# Altium project Power+Solar_PCB.PrjPcb
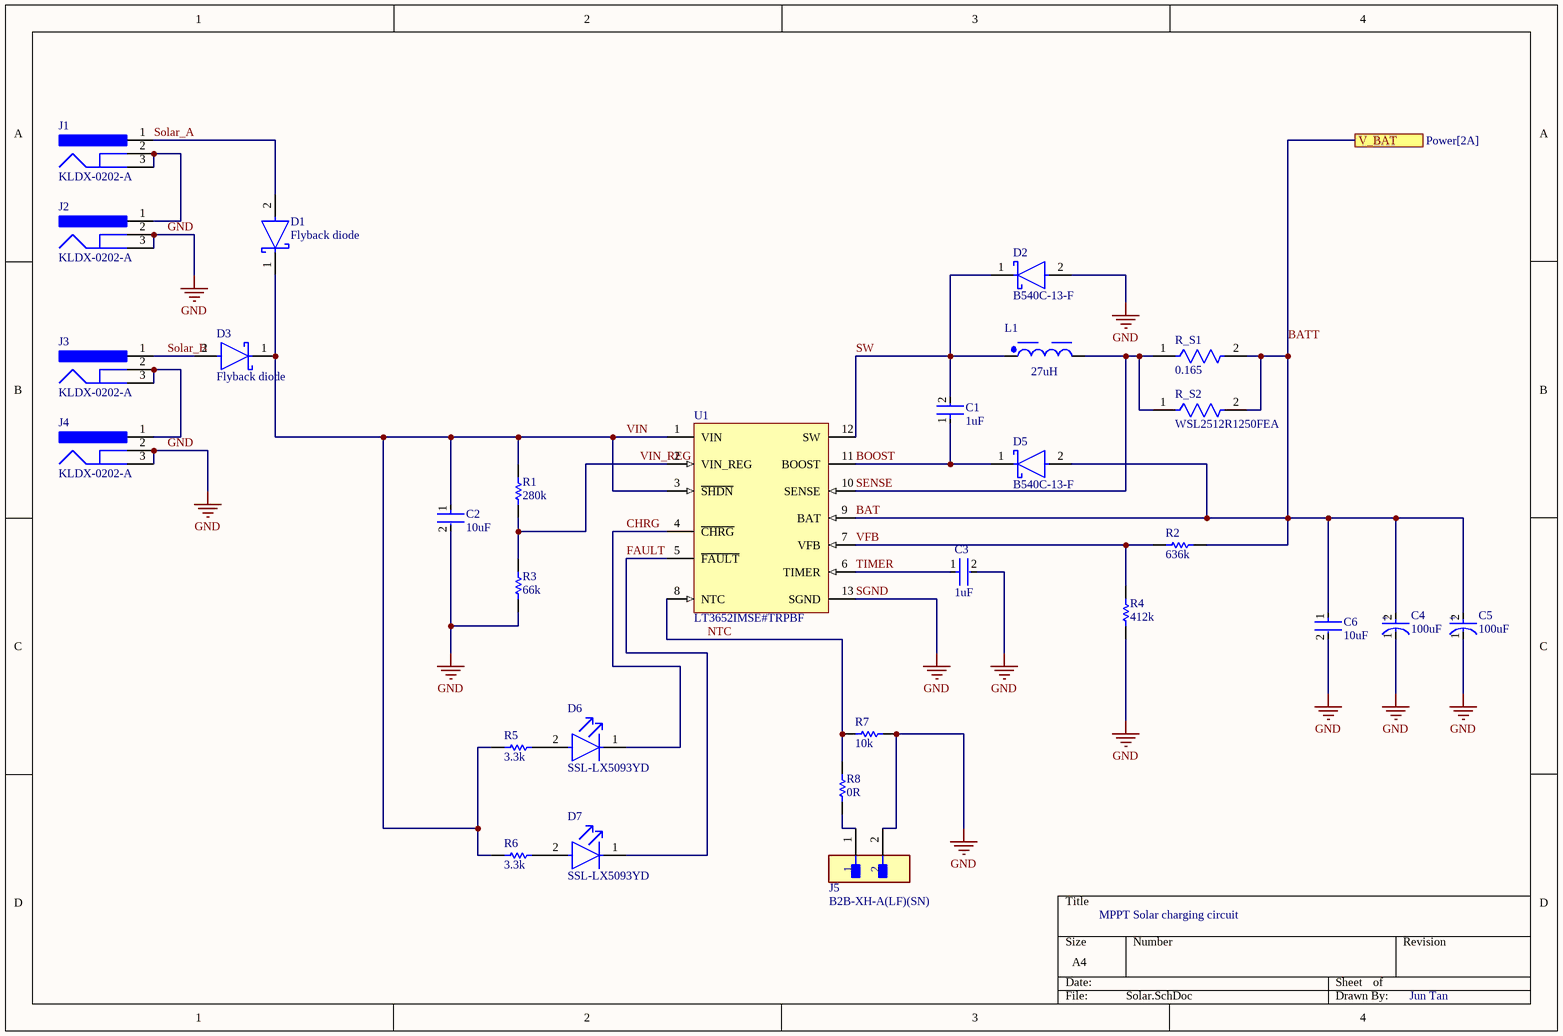
[diagram p0: Solar.SchDoc]
2 sheets, 49 parts. Net scope: flat (ports and power ports of the same name join across sheets).
Board file: Power+Solar_PCB_FINAL.pCBdOC
Sheets:
  Solar.SchDoc
  Power.SchDoc

## Sheet Solar.SchDoc
size A4; SheetNumber: 1; SheetTotal: 2

### Parts
C1  1uF  [FP-CC1206-1_25-MFG]
C2  10uF  [FP-GRM31C-0_2-e0_3_0_8-MFG]
C3  1uF  [FP-CC1206-1_25-MFG]
C4  100uF  [FP-RAD-TH-D_6_3_0_5-L_11-MFG]
C5  100uF  [FP-RAD-TH-D_6_3_0_5-L_11-MFG]
C6  10uF  [FP-GRM31C-0_2-e0_3_0_8-MFG]
D1  Flyback diode  [FP-DO-201AD-MFG]
D2  B540C-13-F  [FP-SMC-MFG]
D3  Flyback diode  [FP-DO-201AD-MFG]
D5  B540C-13-F  [FP-SMC-MFG]
D6  SSL-LX5093YD  [FP-SSL-LX5093YD-MFG]
D7  SSL-LX5093YD  [FP-SSL-LX5093YD-MFG]
J1  KLDX-0202-A  [KYCN-KLDX-0202-A_V]
J2  KLDX-0202-A  [KYCN-KLDX-0202-A_V]
J3  KLDX-0202-A  [KYCN-KLDX-0202-A_V]
J4  KLDX-0202-A  [KYCN-KLDX-0202-A_V]
J5  B2B-XH-A(LF)(SN)  [FP-B2B-XH-A_LF_SN-MFG]
L1  27uH  [WE-PD_7345R]
R1  280k  [RESA60-630X240]
R2  636k  [RESA60-630X240]
R3  66k  [RESA60-630X240]
R4  412k  [RESA60-630X240]
R5  3.3k  [RESA60-630X240]
R6  3.3k  [RESA60-630X240]
R7  10k  [RESA60-630X240]
R8  0R  [RESA60-630X240]
R_S1  0.165  [FP-WSL2512-MFG]
R_S2  WSL2512R1250FEA  [FP-WSL2512-MFG]
U1  LT3652IMSE#TRPBF  [LT-MSE-12-EDP_L]

### Ports
V_BAT (see Power[2A])

### Nets
GND: C2.2 C3.2 C4.1(C) C5.1(C) C6.2 D2.2(A) J2.2 J2.3 J4.2 J4.3 J5.2 R3.1 R4.1 R7.1 U1.13(SGND)  [also labelled SGND]
BAT: C4.2(A) C5.2(A) C6.1 D5.2(A) R2.1 R_S1.2 R_S2.2 U1.9(BAT) ; port V_BAT  [also labelled BATT]
BOOST: C1.1 D5.1(C) U1.11(BOOST)
CHRG: D6.1(C) U1.4(~{CHRG})
FAULT: D7.1(C) U1.5(~{FAULT})
NTC: R7.2 R8.2 U1.8(NTC)
SENSE: L1.2 R_S1.1 R_S2.1 U1.10(SENSE)
Solar_A: D1.2(A) J1.1
Solar_B: D3.2(A) J3.1
SW: C1.2 D2.1(C) L1.1 U1.12(SW)
TIMER: C3.1 U1.6(TIMER)
VFB: R2.2 R4.2 U1.7(VFB)
VIN: C2.1 D1.1(C) D3.1(C) R1.2 R5.2 R6.2 U1.1(VIN) U1.3(~{SHDN})
VIN_REG: R1.1 R3.2 U1.2(VIN_REG)
NetD6_2: D6.2(A) R5.1
NetD7_2: D7.2(A) R6.1
NetJ1_2: J1.2 J1.3 J2.1
NetJ3_2: J3.2 J3.3 J4.1
NetJ5_1: J5.1 R8.1

### Notes on the sheet
- MPPT Solar charging circuit
- Jun Tan
- (in symbol CMP-05427-000856-1) +

### Library data of the parts
C1 C3 = CMP-03422-001060-1: CAP CER 1UF 25V X7R 1206; Manufacturer: Yageo; Manufacturer Part Number: CC1206MKX7R8BB105; Automotive Grade: NA; Material: Ceramic; Temperature Coefficient: 15%; Tolerance: 0.2; Automotive: No; Category: Cap; Device Class L1: Passive Components; Voltage Rating: 25 V; Height: 1.45mm; Temperature Range Low: -55°C; Package: CC1206-1.25; ComponentLink2Description: Datasheet; Device Class L2: Capacitors; RoHS: TRUE; Capacitance: 1 uF; Temperature Characteristic: X7R; Temperature: -55°C to +125°C; Octopart: https://octopart.com/cc1206mkx7r8bb105-yageo-51849253; ComponentLink2URL: http://www.yageo.com/documents/recent/UPY-NP0X7R_HV_1KV-to-3KV_11.pdf; Temperature Range High: +125°C; Lead Free: Yes; Mouser Description: 1206 1 uF 25 V ±20% Tolerance X7R SMT Multilayer Ceramic Capacitor; Value: 1 uF; Footprint Url: http://www.yageo.com/exep/pages/download/literatures/UPY-C_GEN_24.pdf; Digikey Description: CAP CER 1UF 25V X7R 1206; Device Class L3: Ceramic Capacitors
C2 C6 = CMP-06035-003589-1: Chip Multilayer Ceramic Capacitors for General Purpose, 1206, 10uF, X7R, 15%, 10%, 25V; Case Code (Imperial): 1206; Voltage Rating (DC): 25V; Voltage Rating: 25V; Length: 3.2mm; Lead Free: Lead Free; Thickness: 0.071inch; Package Quantity: 1; Width: 1.6mm; Max Operating Temperature: 125°C; Number of Pins: 2; Height: 1.6mm; Case Code (Metric): 3216; REACH SVHC: No SVHC; Radiation Hardening: No; Case/Package: 1206; Material: Ceramic; Tolerance: 10%; Voltage: 25V; Mount: Surface Mount; Packaging: Tape and Reel; Dielectric: X7R; Termination: SMD/SMT; Min Operating Temperature: -55°C; Capacitance: 10uF; Depth: 1.6mm
C4 C5 = CMP-05427-000856-1: Aluminum Electrolytic Capacitors (Radial Lead Type) 100uF ±20% 25V; Lead Diameter: 0.5mm; Polarity: Polar; Ripple Current: 455mA; Impedance: 130mR; Life (Hours): 2000Hour; Length: 11mm; Min Operating Temperature: -40°C; Termination: Radial; Diameter: 6mm; Lead Pitch: 5mm; Tolerance: 20%; Capacitance: 100uF; Case/Package: Radial; Voltage Rating (DC): 25V; Height - Seated (Max): 0.5inch; RoHS Compliant: Yes; Series: FM; Package Quantity: 2000; Voltage Rating: 25V; Max Operating Temperature: 105°C; Mount: Through Hole; ESR (Equivalent Series Resistance): 130mR; Packaging: Tape and Reel
D1 D3 = CMP-12187-000025-1: DIODE SCHOTTKY 40V 3A DO201AD; Manufacturer Part Number: 1N5822; Manufacturer: STMicroelectronics; Max Junction Temp: +150°C; Peak Reverse Current: 2mA; Max Surge Forward Current: 80A; Temperature Range High: +150°C; Automotive: No; RoHS: TRUE; ComponentLink2Description: Datasheet; Lead Free: Yes; Octopart: https://octopart.com/1n5822-stmicroelectronics-323225; Device Class L2: Diodes; Max Repetitive Reverse Voltage: 40V; Temperature: to +150°C; Height: 5.3mm; Category: Diode; Digikey Description: DIODE SCHOTTKY 40V 3A DO201AD; ComponentLink2URL: https://www.st.com/resource/en/datasheet/1n5822.pdf; Device Class L3: Schottky Diodes; Device Class L1: Discrete Semiconductors; Forward Current: 3A; Mouser Description: Schottky Diodes & Rectifiers Vr/40V Io/3A BULK; Package: DO-201AD
D2 D5 = CMP-2000-05097-3: DIODE SCHOTTKY 40V 5A SMC; Manufacturer: Diodes Inc.; Automotive Grade: NA; Peak Reverse Current: 0.5mA; Value: 300pF; Max Junction Temp: +150°C; Max Surge Forward Current: 100A; Standoff Height: 0.1mm; Digikey Description: DIODE SCHOTTKY 40V 5A SMC; Temperature Range Low: -55°C; Manufacturer Part Number: B540C-13-F; Octopart: https://octopart.com/b540c-13-f-diodes+inc.-325873; Lead Free: Yes; Reverse Voltage: 40V; RoHS: TRUE; Category: Diode; Mouser Description: Diode: Schottky rectifying; SMD; 40V; 5A; SMC; Package: reel, tape; ComponentLink2Description: Datasheet; Temperature Range High: +150°C; Automotive: No; Footprint Url: https://www.diodes.com/assets/Package-Files/SMC.pdf; Device Class L3: Schottky Diodes; Height: 2.5mm; Forward Current: 5A; Temperature: -55°C to +150°C; Package: SMC; ComponentLink2URL: https://www.diodes.com/assets/Datasheets/ds13012.pdf; Device Class L2: Diodes; Max Repetitive Reverse Voltage: 40V; Device Class L1: Discrete Semiconductors; Capacitance: 300pF
D6 D7 = CMP-57192-000007-1: LED YELLOW DIFFUSED T-1 3/4 T/H; Test Current: 20mA; Number of LEDs: 1; Dominant Wavelength: 568nm; Wavelength: 585nm; Forward Voltage: 2.1V; Lens Style: Dome; Viewing Angle: 60°; Luminous Intensity: 30mcd; Min Operating Temperature: -40°C; Packaging: Bulk; Width: 1.5inch; Lead Free: Lead Free; Number of Pins: 2; Color: Yellow; Case/Package: Radial; Forward Current: 20mA; REACH SVHC: No SVHC; Lens Transparency: Diffused; Weight: 0.01lb; Height: 8.6mm; Package Quantity: 1000; Series: -; Length: 0.5inch; Illumination Color: Yellow; Mount: Through Hole; Diameter: 5mm; RoHS Compliant: Yes; Lens Color: Yellow; Max Operating Temperature: 85°C
J1-J4 = CMP-1673-00001-5: DC Power Jack, 24 V, 3.5 A, -25 to 85 degC, 3-Pin THD, RoHS; Manufacturer: Kycon; Voltage Rating: 24 V; Current Rating: 3.5 A; Height: 10.8 mm; Length: 9.2 mm; Pins: 2; Housing Material: PBT; Connector Type: Power; ComponentLink2URL: http://www.kycon.com/Pub_Eng_Draw/KLDX-0202-X.PDF; PackageDescription: 3-Pin Through Hole Device, Body 14.5 x 9 mm; Max Operating Temperature: 85 degC; Min Operating Temperature: -25 degC; PackageReference: KLDX-0202-A; Contact Gender: Female; Package Quantity: 500; Mount: Through Hole; Colour: Black; Contact Plating: Tin; DatasheetVersion: Rev. D3, 06/2013; ComponentLink2Description: Datasheet; RoHSCompliant: true; Mounting Technology: Through Hole; ComponentLink1Description: Manufacturer URL; Contact Material: Brass; ComponentLink1URL: http://www.kycon.com/
J5 = CMP-2000-05888-3: CONN HEADER VERT 2POS 2.5MM; Current Rating: 3A; Voltage Rating: 250V; Number of Contacts: 2; Contact Resistance: 20mR; Wire/Cable Gauge: 22AWG; Insulation Resistance: 1GR; Connector Type: Male Pin; Packaging: Bulk; Contact Material: Brass; Lead Free: Lead Free; Orientation: Straight; Contact Plating: Tin; Max Current Rating: 3A; Termination: Solder; Fastening Type: Detent; Depth: 5.75mm; Housing Material: Polyamide; REACH SVHC: No SVHC; Series: XH; Voltage Rating (AC): 250V; Number of Positions: 2; Color: Natural; Contact Type: Male Pin; Max Voltage Rating (DC): 250V; Pitch: 2.5mm; Lead Pitch: 2.5mm; Mount: Through Hole; Max Operating Temperature: 85°C; Length: 7.4mm; Max Voltage Rating (AC): 250V; Min Operating Temperature: -25°C; Number of Rows: 1; Housing Color: White
L1 = CMP-1396-00053-3: WE-PD Robust SMT Shielded Power Inductor; Self Resonant Frequency: 13MHz; RMS Current (Irms): 1.24A; Inductance: 27µH; Test Frequency: 1kHz; Tolerance: 20%; Series Resistance: 150mΩ; Saturation Current: 1.55A; Core Material: Ferrite; DC Resistance (DCR): 120mΩ; Ambient Temperature Range Low: -40°C; Ambient Temperature Range High: 85°C; Mount: Surface Mount; Length: 7.3mm; Max Operating Temperature: 125°C; Min Operating Temperature: -40°C; Max DC Current: 1.24A; Case/Package: Nonstandard; Depth: 7.3mm; Composition: Wirewound; Inductance Tolerance: 20%; RoHS: Compliant; Resistance: 150mΩ; Height - Seated (Max): 4.4958mm; Number of Pins: 2; Shielding: Shielded; REACH SVHC: Unknown; Width: 7.3mm; Current Rating: 1.24A; Termination: SMD/SMT; Height: 4.5mm
R1-R8 = CMP-1659-00071-1: Axial Resistor, 100 Ohm, +/- 1%, 0.25 W, -55 to 155 degC, 2-Pin THD, RoHS, Bulk; Voltage Rating: 250 V; Resistance: 4.75 kohm; Power Rating: 250 mW; Type (Resistor): Metal Film; Package Quantity: 200; RoHSCompliant: true; ComponentLink1URL: http://www.yageo.com/; ComponentLink1Description: Manufacturer URL; Case\Package: Axial; ComponentLink2Description: Datasheet; Length: 0.248 inch; PackageReference: MFR-25; Max Operating Temperature: 155 degC; Min Operating Temperature: -55 degC; DatasheetVersion: Apr-13; Mount: Through Hole; PackageDescription: 2-Pin Axial Lead, Dia 2.4 mm, Body Length 6.3 mm; Packaging: Bulk; Tolerance: 1%; ComponentLink2URL: http://www.yageo.com/documents/recent/Yageo%20LR_MFR_2013.pdf
R_S1 R_S2 = CMP-02407-012716-1: Res Metal Strip 2512 0.125 Ohm 1% 1W ±75ppm/°C Molded SMD SMD Embossed Plastic T/R; Resistance: 125mR; Packaging: Tape and Reel; RoHS Compliant: Yes; Resistor Type: Metal Strip; Max Operating Temperature: 170°C; Length: 6.35mm; Width: 3.17mm; Height: 635um; Temperature Coefficient: 75ppm/°C; Min Operating Temperature: -65°C; Case/Package: 2512; Lead Free: Lead Free; Radiation Hardening: No; Tolerance: 1%; Contact Plating: Tin; Power Rating: 1W
U1 = CMP-0473-00135-1: Power Tracking 2 A Battery Charger for Solar Power, 12-pin SOP (MSE-12-EDP), -40 to 125 degC, Pb-Free, Tape and Reel; Manufacturer: Linear Technology; Number of Outputs: 1; Vin Max(V): 32; Vin Min(V): 4.95; PackageDescription: 12-Pin Plastic MSOP, Exposed Die Pad, Body 4.039 x 3 mm, Pitch 0.65 mm; DatasheetVersion: Rev. D; ComponentLink3Description: Package Specification; Energy Source: Solar; PartNumber: LT3652IMSE#TRPBF; ComponentLink2URL: http://cds.linear.com/docs/en/datasheet/3652fd.pdf; PackageVersion: Rev. G, 05/2013; ComponentLink1Description: Manufacturer URL; Packing: Tape and Reel; Mounting Technology: Surface Mount; ComponentLink1URL: http://www.linear.com/; ComponentLink2Description: Datasheet; PackageReference: MSE-12-EDP; Topology: Battery Charger; RoHS: TRUE; ComponentLink3URL: http://cds.linear.com/docs/en/packaging/05081666_G_MSE12.pdf

## Sheet Power.SchDoc
size A4; SheetNumber: 2; SheetTotal: 2
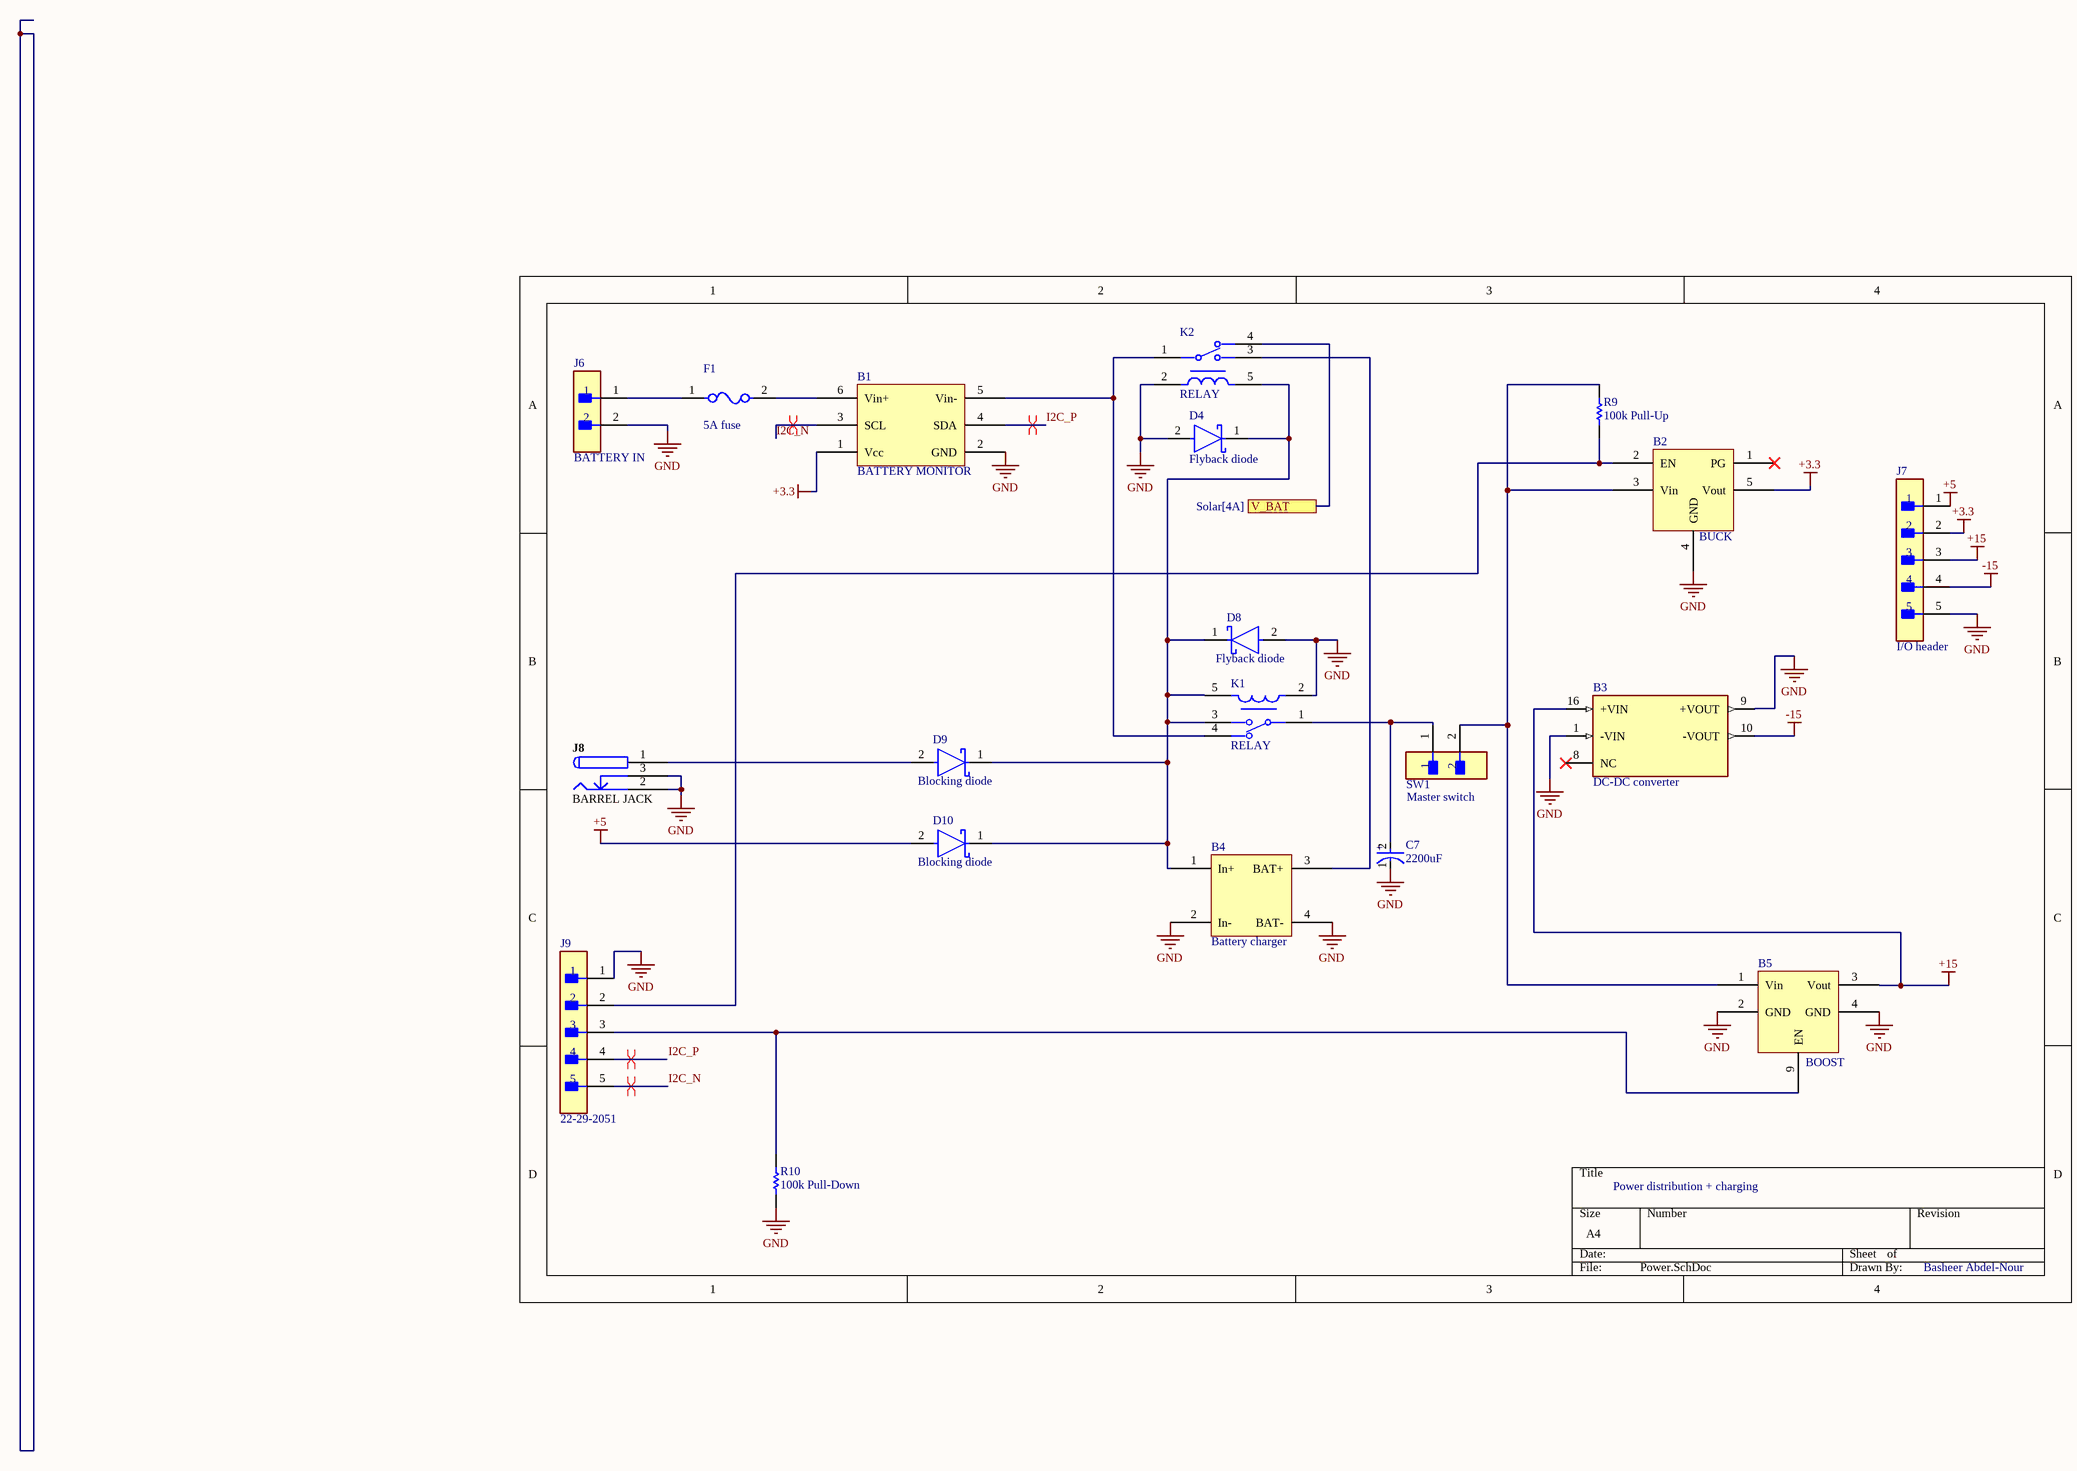
[diagram p1: Power.SchDoc]

### Parts
B1  BATTERY MONITOR  [Adafruit 904]
B2  BUCK  [Pololu Buck converter]
B3  DC-DC converter  [DC-DC converter]
B4  Battery charger  [Battery charger]
B5  BOOST  [Pololu boost converter]
C7  2200uF  [FP-RAD-TH-D_16_0_5-L_25_2-MFG]
D4  Flyback diode  [FP-DO-201AD-MFG]
D8  Flyback diode  [FP-DO-201AD-MFG]
D9  Blocking diode  [FP-DO-201AD-MFG]
D10  Blocking diode  [FP-DO-201AD-MFG]
F1  5A fuse  [FP-0PTF0078P-MFG]
J6  BATTERY IN  [FP-26-61-4020-MFG]
J7  I/O header  [FP-26-60-4050-MFG]
J8  BARREL JACK  [KYCN-KLDX-0202-B_V]
J9  22-29-2051  [FP-22-29-2051-MFG]
K1  RELAY  [FP-G5LE-1-E_DC5-MFG]
K2  RELAY  [FP-G5LE-1-E_DC5-MFG]
R9  100k Pull-Up  [RESA60-630X240]
R10  100k Pull-Down  [RESA60-630X240]
SW1  Master switch  [FP-26-61-4020-MFG]

### Ports
V_BAT (see Solar[4A])

### Nets
+3.3: B1.1(Vcc) B2.5(Vout) J7.2
+5: D10.2(A) J7.1
+15: B3.16(+VIN) B5.3(Vout) J7.3
-15: B3.10(-VOUT) J7.4
GND: B1.2(GND) B2.4(GND) B3.1(-VIN) B3.9(+VOUT) B4.2(In-) B4.4(BAT-) B5.2(GND) B5.4(GND) C7.1(C) D4.2(A) D8.2(A) J6.2 J7.5 J8.2 J8.3 J9.1 K1.2 K2.2 R10.1
BAT: K2.4 ; port V_BAT
I2C_N: B1.3(SCL) J9.5
I2C_P: B1.4(SDA)
NetB1_5: B1.5(Vin-) K1.4 K2.1
NetB1_6: B1.6(Vin+) F1.2
NetB2_2: B2.2(EN) J9.2 R9.1
NetB2_3: B2.3(Vin) B5.1(Vin) R9.2 SW1.2
NetB4_1: B4.1(In+) D4.1(C) D8.1(C) D9.1(C) D10.1(C) K1.3 K1.5 K2.5
NetB4_3: B4.3(BAT+) K2.3
NetB5_9: B5.9(EN) J9.3 R10.2
NetC7_2: C7.2(A) K1.1 SW1.1
NetD9_2: D9.2(A) J8.1
NetF1_1: F1.1 J6.1

Not connected (* = marked no-connect by the designer): B2 1(PG)*; B3 8(NC)*; J9 4

### Layout directives
differential pair: I2C_N, I2C_P, NetJ9_4

### Notes on the sheet
- Power distribution + charging
- Basheer Abdel-Nour
- Labels drawn without touching a wire or pin: I2C_P
- (in symbol CMP-05427-000889-1) +

### Library data of the parts
B1 = Adafruit 904
B2 = Pololu_buck
B5 = Pololu_boost
C7 = CMP-05427-000889-1: Aluminum Electrolytic Capacitors (Radial Lead Type) AEC-Q200 Qualified 2200uF ±20% 25V; Outside Diameter: 16mm; Lead/Base Style: Straight; Leakage Current: 550uA; ESR (Equivalent Series Resistance): 22mR; Capacitance: 2.2mF; Life (Hours): 2000Hour; Ripple Current (AC): 2.76A; Ripple Current: 2.3A; Lead Diameter: 0.8mm; Voltage Rating (DC): 25V; Lead Pitch: 7.5mm; Construction: RADIAL; Tolerance: 20%; Mount: Through Hole; Number of Pins: 2; Min Operating Temperature: -40°C; Package Quantity: 100; Radiation Hardening: No; Height: 25mm; RoHS Compliant: Yes; Termination: Radial; Voltage Rating: 25V; Diameter: 16mm; Packaging: Bulk; Case/Package: Radial; Series: TP; Voltage: 25V; Length: 25mm; Max Operating Temperature: 135°C; Height - Seated (Max): 1.063inch; REACH SVHC: No SVHC
D4 D8-D10 = CMP-12187-000025-1: as D1 on sheet Solar; Temperature Range High: +150°C; Automotive: No; RoHS: TRUE; ComponentLink2Description: Datasheet; Lead Free: Yes; Octopart: https://octopart.com/1n5822-stmicroelectronics-323225; Device Class L2: Diodes; Max Repetitive Reverse Voltage: 40V; Temperature: to +150°C; Height: 5.3mm; Category: Diode; Digikey Description: DIODE SCHOTTKY 40V 3A DO201AD; ComponentLink2URL: https://www.st.com/resource/en/datasheet/1n5822.pdf; Device Class L3: Schottky Diodes; Device Class L1: Discrete Semiconductors; Forward Current: 3A; Mouser Description: Schottky Diodes & Rectifiers Vr/40V Io/3A BULK; Package: DO-201AD
F1 = CMP-08604-000023-1: FUSE BLOCK CARTRIDGE PCB; Manufacturer Part Number: 0PTF0078P; Manufacturer: Littelfuse Inc; Number Of Fuses: 1; Conn Orientation: Vertical; Fuse Current: 6.3A; Voltage Rating Ac: 250V; Package: 0; Ambient Temperature Range Low: -30°C; ComponentLink2URL: https://media.digikey.com/pdf/Data%20Sheets/Littelfuse%20PDFs/PTF075_77_78.pdf; Device Class L3: unset; Lead Free: Yes; Device Class L1: Circuit Protection; RoHS: TRUE; Ambient Temperature Range High: +85°C; Category: Fuse; Octopart: https://octopart.com/0ptf0078p-littelfuse-13255855; Digikey Description: FUSE BLOCK CARTRIDGE PCB; Height: 11.5mm; ComponentLink2Description: Datasheet; Device Class L2: Fuse Holders; Mouser Description: Fuse Holder 5X20MM Pitch 22/7 UL94V0 Open; Automotive: No; Voltage Rating Dc: 250V
J6 SW1 = CMP-00257-00277943-1: 26-61-4020 3.96mm (.156") Pitch KK® Solid Header, Vertical, Friction Lock, 2 Circuits, Gold (Au) Plating; NexarPartId: 277943; Manufacturer Lifecycle Status: ACTIVE; Number of Positions: 2; Contact Resistance: 6mΩ; Voltage Rating (DC): 250V; Glow Wire Compliant: Non-compliant; Max Current Rating: 7A; Insulation Resistance: 50GΩ; Gender: Male; Pitch: 3.96mm; Orientation: Right Angle, Vertical; Number of Circuits: 2; Length: 7.77mm; Depth: 10.01mm; Min Operating Temperature: 0°C; Mount: Through Hole; Lifecycle Status: Production; Lead Pitch: 3.96mm; Packaging: Bulk; Voltage Rating: 250V; Flammability Rating: UL94 V-0; Schedule B: 8536694040; Country of Origin: US; Contact Plating: Gold; Housing Color: Natural; Lead Free: Lead Free; Housing Material: Polyester; RoHS: Compliant; Color: Natural; Contact Material: Brass; REACH SVHC: Unknown; Number of Contacts: 2; Number of Rows: 1; Height: 14.73mm; Current Rating: 7A; Termination: Solder; Max Operating Temperature: 75°C; Max Voltage Rating (AC): 250V; Radiation Hardening: No
J7 = CMP-04776-000344-1: CONN HEADER VERT 5POS 3.96MM; Voltage Rating: 250V; Insulation Resistance: 50GR; Number of Lines: 1; Number of Positions: 5; Approvals: UL; Gender: Male; Glow Wire Compliant: Non-compliant; Contact Resistance: 6mR; Current Rating: 7A; Housing Color: Natural; Pitch: 3.96mm; Color: Natural; Contact Material: Brass; Flammability Rating: UL94 V-0; Contact Gender: Male; Number of Rows: 1; Max Operating Temperature: 75°C; Radiation Hardening: No; Series: KK® 41791; Voltage Rating (DC): 250V; Contact Mating Length: 0.45inch; Lead Free: Lead Free; Mount: Through Hole; Housing Material: Polyester; Orientation: Straight; Contact Plating: Tin; Min Operating Temperature: 0°C; Contact Type: Male Pin; Fastening Type: Friction; Material: Polyester; Termination: Solder; Number of Poles: 5; Depth: 10.01mm; RoHS Compliant: Yes; Package Quantity: 400; Number of Circuits: 5; Packaging: Bulk; Max Voltage Rating (AC): 250V; Number of Contacts: 5
J8 = CMP-0256-00001-1: 3 Conductor Power Jack, 2 break 2 aux contacts; PartNumber: KLDX-0202-B; ComponentLink2URL: http://anacapa.kycon.com/Catalog_PDF/KLDX_0202.pdf; PackageReference: KLDX-0202-B; Contact Finish: Brass; ComponentLink2Description: Datasheet; Mounting Technology: Through Hole; PackageDescription: Jack, 9 x 14.5 mm Body, 2.5 mm Center Pin Diameter; ComponentLink1Description: Manufacturer URL; ComponentLink1URL: http://kycon.com/
J9 = CMP-04776-000816-1: 2.54MM KK HDR VT FRICLK VRA .5AU; Number of Circuits: 5; Connector Type: Male Pin; Max Current Rating: 7A; Glow Wire Compliant: Non-compliant; Insulation Resistance: 50GR; Gender: Male; Current Rating: 4A; Number of Lines: 1; Max Voltage Rating (AC): 250V; Contact Resistance: 10mR; Orientation: Straight; Height: 14.73mm; Contact Plating: Gold; Series: KK® 6410; Number of Poles: 5; Mount: Through Hole; Length: 12.7mm; Packaging: Bulk; Package Quantity: 10; Depth: 5.8mm; Housing Color: White; Pitch: 2.54mm; Number of Positions: 5; Contact Mating Length: 0.295inch; Max Operating Temperature: 75°C; Housing Material: Nylon; Termination: Solder; Contact Material: Brass; Flammability Rating: UL94 V-0; Number of Contacts: 5; Color: Natural; Min Operating Temperature: 0°C; Radiation Hardening: No; Contact Type: Male Pin; Number of Rows: 1; Voltage Rating: 250V; Voltage Rating (DC): 250V; Contact Gender: Male; Fastening Type: Friction; Lead Free: Lead Free; Halogen Free: Low Halogen
K1 K2 = CMP-08822-000286-1: RELAY GEN PURPOSE SPDT 16A 5V; Power Consumption: 400mW; Coil Resistance: 63R; Coil Type: Non-Latching; Release Time: 5ms; Max Voltage Rating (AC): 250V; Relay Type: General Purpose; Life (Hours): 1000000Hour; Coil Current: 79.4mA; Operate Time: 10ms; Packaging: Rail/Tube; Lead Free: Lead Free; Throw Configuration: SPDT; Termination: Solder; Height: 19mm; Series: G5LE; RoHS Compliant: Yes; Min Operating Temperature: -25°C; Package Quantity: 100; Width: 16.5mm; Contact Material: Tin; Length: 22.5mm; Coil Power: 400mW; Coil Voltage (DC): 5V; Depth: 16.5mm; Radiation Hardening: No; Max Current Rating: 16A; Contact Current Rating: 16A; Weight: 12g; Max Operating Temperature: 85°C; Number of Pins: 5; Mount: PCB
R9 R10 = CMP-1659-00073-1: Axial Resistor, 100 KOhm, +/- 1%, 0.25 W, -55 to 155 degC, 2-Pin THD, RoHS, Bulk; Voltage Rating: 250 V; Power Rating: 250 mW; Resistance: 475 Ohm; PackageDescription: 2-Pin Axial Lead, Dia 2.4 mm, Body Length 6.3 mm; PackageReference: MFR-25; Length: 0.248 inch; ComponentLink2Description: Datasheet; Packaging: Bulk; DatasheetVersion: Apr-13; Package Quantity: 200; Min Operating Temperature: -55 degC; ComponentLink2URL: http://www.yageo.com/documents/recent/Yageo%20LR_MFR_2013.pdf; RoHSCompliant: true; ComponentLink1URL: http://www.yageo.com/; Tolerance: 1%; Case\Package: Axial; Mount: Through Hole; ComponentLink1Description: Manufacturer URL; Max Operating Temperature: 155 degC

## Nets that join several sheets
GND: Solar (15 pins), Power (19 pins)
BAT: Solar (8 pins), Power (K2.4)